# Altium project PCB_Project.PrjPcb
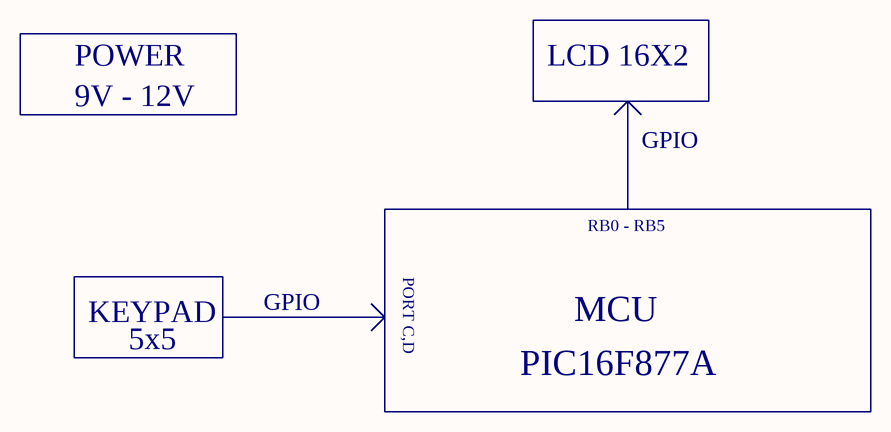
[diagram p0: Diagram.SchDoc]
5 sheets, 47 parts. Net scope: global (net labels, ports and power ports of the same name join across sheets).
Sheets:
  Diagram.SchDoc
  Power.SchDoc
  MCU.SchDoc
  Keypad.SchDoc
  Display.SchDoc

## Sheet Diagram.SchDoc
size A

### Notes on the sheet
- POWER
- 9V - 12V
- LCD 16X2
- GPIO
- RB0 - RB5
- KEYPAD
- PORT C,D
- MCU
- 5x5
- PIC16F877A

## Sheet Power.SchDoc
size A
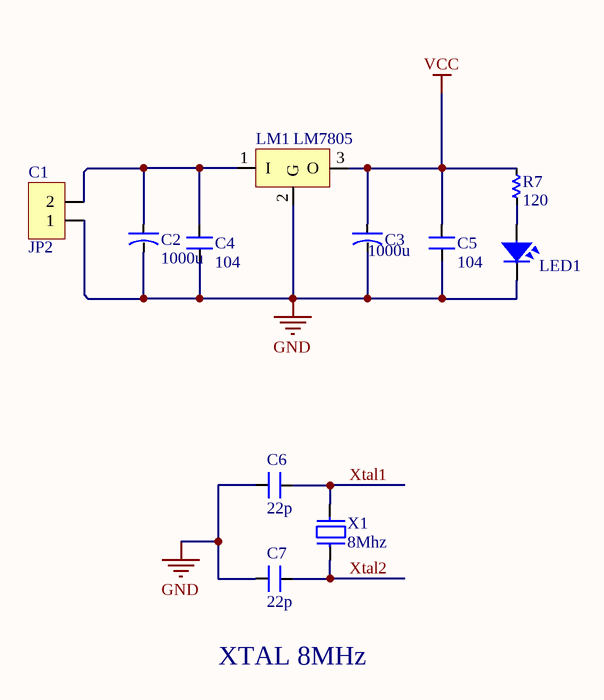
[diagram p1: Power.SchDoc]

### Parts
C1  JP2  [JP2-D1T]
C2  1000u  [CA-ALU-2.54]
C3  1000u  [CA-ALU-2.54]
C4  104  [C-SE-7,5x11x13x9x4]
C5  104  [C-SE-7,5x11x13x9x4]
C6  22p  [C-SE-7,5x11x13x9x4]
C7  22p  [C-SE-7,5x11x13x9x4]
LED1  LED  [LED-3MM-RED]  (value not drawn)
LM1  LM78xx  [TO92-321]  (value not drawn)
R7  120  [RES-1/2W]
X1  8Mhz  [XT2]

### Nets
GND: C1.1 C2.2 C3.2 C4.1 C5.1 C6.1 C7.1 LED1.2 LM1.2(G)
VCC: C3.1 C5.2 LM1.3(O) R7.1
Xtal1: C6.2 X1.2
Xtal2: C7.2 X1.1
NetC1_2: C1.2 C2.1 C4.2 LM1.1(I)
NetLED1_1: LED1.1 R7.2

### Notes on the sheet
- (near LM1) LM7805
- XTAL 8MHz

### Library data of the parts
C1 = JP2: WR-PHD 2.54 mm Angled Socket Header; pin to pad: 1>2 2>1; Manufacturer: W¨¹rth Elektronik eiSos GmbH; partNo: 613002143121; ComponentLink1 Description: Manufacturer; ComponentLink2 Description: Datasheet; NoPins: 02; Rule: PcbType=ProtelPcb; Created Date: 29 March 2013; ComponentLink1URL: http://www.we-online.com; ComponentLink2URL: http://katalog.we-online.de/em/datasheet/6130xx143121.pdf; Created by: Karrer Zheng
C2 C3 = CN-ALU-DIP: Capacitor (Semiconductor SIM Model); Value: 104; LatestRevisionDate: 17-Jul-2002; LatestRevisionNote: Re-released for DXP Platform.; PackageReference: C1206; Publisher: Altium Limited
C4 C5 = CN-SEMI-DIP: Capacitor (Semiconductor SIM Model); LatestRevisionDate: 17-Jul-2002; LatestRevisionNote: Re-released for DXP Platform.; PackageReference: C1206; Publisher: Altium Limited; Value: 104
C6 C7 = CN-SEMI-DIP: Capacitor (Semiconductor SIM Model); Value: 104; LatestRevisionDate: 17-Jul-2002; LatestRevisionNote: Re-released for DXP Platform.; PackageReference: C1206; Publisher: Altium Limited
LED1 = LED: LED Single colour Green and Red; Value: LED 3 ly Single Colour
LM1 = LM78xx: Positive Voltage Regulator; Note: Tab is connected to pin 3 (GND).; Published: 24-Aug-2001; LatestRevisionDate: 17-Jul-2002; LatestRevisionNote: Re-released for DXP Platform.; DatasheetVersion: Apr-1994; PackageVersion: Jul-1998; PackageReference: ISOWATT220AB; Publisher: Altium Limited; PackageDescription: TO, Thru-Hole, Vertical, Heatsink Mounted; 3 In-Line Leads; Pitch 2.54 mm; Pin sequence 1, 3, 2; ComponentLink1Description: Manufacturer Link; ComponentLink1URL: http://www.st.com/; ComponentLink2Description: Datasheet; ComponentLink2URL: http://www.st.com/stonline/products/literature/ds/2146/l78m05c.pdf
R7 = Res: Manufacturer: Generic Components; Class: Passive; SubClass: R; Published: 08/06/2000; Publisher: Altium Hobart Technology Centre
X1 = XT2: Crystal, 32.768 KHz, -40 to 85 degC, 3.2 x 1.5 x 0.9 mm SMD; Value: 4Mhz

## Sheet MCU.SchDoc
size A
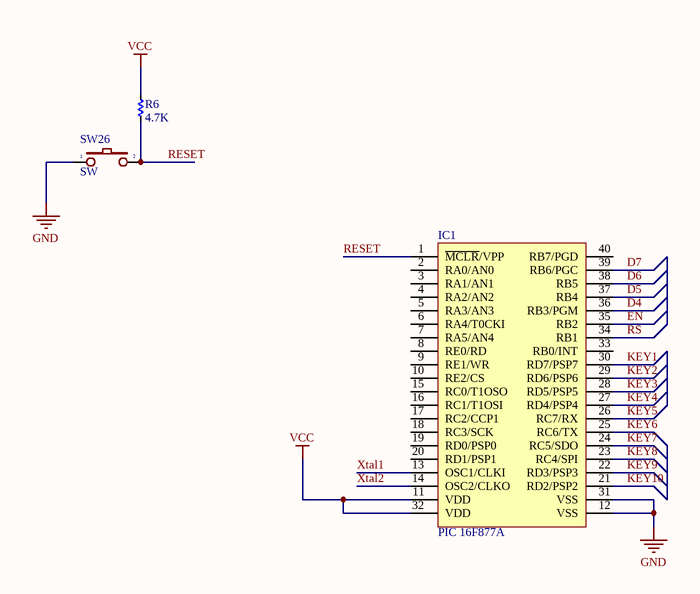
[diagram p2: MCU.SchDoc]

### Parts
IC1  PIC 16F877A  [DIP40/W0.6]
R6  4.7K  [RES-1/2W]
SW26  SW  [SW-DIP1-1]

### Nets
GND: IC1.12(VSS) IC1.31(VSS) SW26.1
VCC: IC1.11(VDD) IC1.32(VDD) R6.1
D4: IC1.36(RB3/PGM)
D5: IC1.37(RB4)
D6: IC1.38(RB5)
D7: IC1.39(RB6/PGC)
EN: IC1.35(RB2)
KEY1: IC1.30(RD7/PSP7)
KEY2: IC1.29(RD6/PSP6)
KEY3: IC1.28(RD5/PSP5)
KEY4: IC1.27(RD4/PSP4)
KEY5: IC1.26(RC7/RX)
KEY6: IC1.25(RC6/TX)
KEY7: IC1.24(RC5/SDO)
KEY8: IC1.23(RC4/SPI)
KEY9: IC1.22(RD3/PSP3)
KEY10: IC1.21(RD2/PSP2)
RESET: IC1.1(~{MCLR}/VPP) R6.2 SW26.2
RS: IC1.34(RB1)
Xtal1: IC1.13(OSC1/CLKI)
Xtal2: IC1.14(OSC2/CLKO)

Not connected (* = marked no-connect by the designer): IC1 2(RA0/AN0) 3(RA1/AN1) 4(RA2/AN2) 5(RA3/AN3) 6(RA4/T0CKI) 7(RA5/AN4) 8(RE0/RD) 9(RE1/WR) 10(RE2/CS) 15(RC0/T1OSO) 16(RC1/T1OSI) 17(RC2/CCP1) 18(RC3/SCK) 19(RD0/PSP0) 20(RD1/PSP1) 33(RB0/INT) 40(RB7/PGD)

### Library data of the parts
IC1 = PIC16F877-PU: 8K FLASH, 368B RAM, 256B EFROM; Value: DIP 40; Value: PIC16F877A; Copyright by: VanDungEvn
R6 = Res: as R7 on sheet Power; Published: 08/06/2000; Publisher: Altium Hobart Technology Centre
SW26 = SW2: Switch button 2 pin; Value: SW chip 2 pin

## Sheet Keypad.SchDoc
size A
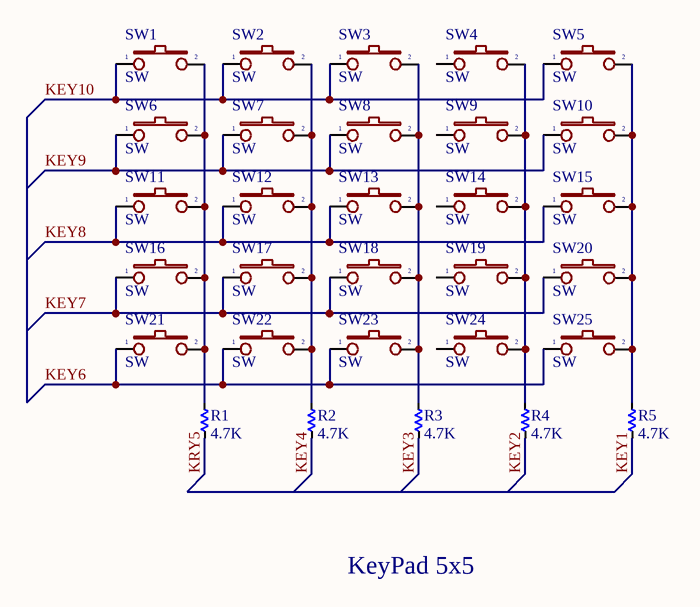
[diagram p3: Keypad.SchDoc]

### Parts
R1  4.7K  [RES-1/2W]
R2  4.7K  [RES-1/2W]
R3  4.7K  [RES-1/2W]
R4  4.7K  [RES-1/2W]
R5  4.7K  [RES-1/2W]
SW1  SW  [SW-DIP1-1]
SW2  SW  [SW-DIP1-1]
SW3  SW  [SW-DIP1-1]
SW4  SW  [SW-DIP1-1]
SW5  SW  [SW-DIP1-1]
SW6  SW  [SW-DIP1-1]
SW7  SW  [SW-DIP1-1]
SW8  SW  [SW-DIP1-1]
SW9  SW  [SW-DIP1-1]
SW10  SW  [SW-DIP1-1]
SW11  SW  [SW-DIP1-1]
SW12  SW  [SW-DIP1-1]
SW13  SW  [SW-DIP1-1]
SW14  SW  [SW-DIP1-1]
SW15  SW  [SW-DIP1-1]
SW16  SW  [SW-DIP1-1]
SW17  SW  [SW-DIP1-1]
SW18  SW  [SW-DIP1-1]
SW19  SW  [SW-DIP1-1]
SW20  SW  [SW-DIP1-1]
SW21  SW  [SW-DIP1-1]
SW22  SW  [SW-DIP1-1]
SW23  SW  [SW-DIP1-1]
SW24  SW  [SW-DIP1-1]
SW25  SW  [SW-DIP1-1]

### Nets
KEY1: R5.2
KEY2: R4.2
KEY3: R3.2
KEY4: R2.2
KEY6: SW21.1 SW22.1 SW23.1 SW25.1
KEY7: SW16.1 SW17.1 SW18.1 SW20.1
KEY8: SW11.1 SW12.1 SW13.1 SW15.1
KEY9: SW6.1 SW7.1 SW8.1 SW10.1
KEY10: SW1.1 SW2.1 SW3.1 SW5.1
KRY5: R1.2
NetR1_1: R1.1 SW1.2 SW6.2 SW11.2 SW16.2 SW21.2
NetR2_1: R2.1 SW2.2 SW7.2 SW12.2 SW17.2 SW22.2
NetR3_1: R3.1 SW3.2 SW8.2 SW13.2 SW18.2 SW23.2
NetR4_1: R4.1 SW4.2 SW9.2 SW14.2 SW19.2 SW24.2
NetR5_1: R5.1 SW5.2 SW10.2 SW15.2 SW20.2 SW25.2

Not connected (* = marked no-connect by the designer): SW4 1; SW9 1; SW14 1; SW19 1; SW24 1

### Notes on the sheet
- KeyPad 5x5

### Library data of the parts
R1-R5 = Res: as R7 on sheet Power; Published: 08/06/2000; Publisher: Altium Hobart Technology Centre
SW1-SW25 = SW2: as SW26 on sheet MCU

## Sheet Display.SchDoc
size A
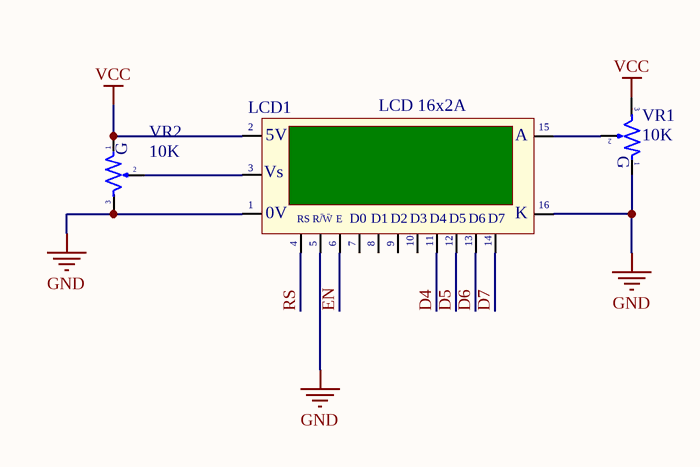
[diagram p4: Display.SchDoc]

### Parts
LCD1  LCD 16x2A  [LCD16X2]
VR1  10K  [VR-S2]
VR2  10K  [VR-S2]

### Nets
GND: LCD1.1(GND) LCD1.5(R/~{W}) LCD1.16(K) VR1.1 VR2.3
VCC: LCD1.2(VDD) VR1.3 VR2.1
D4: LCD1.11(D4)
D5: LCD1.12(D5)
D6: LCD1.13(D6)
D7: LCD1.14(D7)
EN: LCD1.6(~{EN})
RS: LCD1.4(RS)
NetLCD1_3: LCD1.3(VEE) VR2.2
NetLCD1_15: LCD1.15(A) VR1.2

Not connected (* = marked no-connect by the designer): LCD1 7(D0) 8(D1) 9(D2) 10(D3)

### Notes on the sheet
- (in symbol LCD16x2A) 5V; Vs; |; 0V; R/W; E
- (in symbol VR-S) G

### Library data of the parts
LCD1 = LCD16x2A: LCD dipslay 16 char, 2 line; Value: LCD16x2A
VR1 VR2 = VR-S: Var Resistor; Value: Volume 50k

## Nets that join several sheets
GND: Power (9 pins), MCU (IC1.12 IC1.31 SW26.1), Display (5 pins)
VCC: Power (C3.1 C5.2 LM1.3 R7.1), MCU (IC1.11 IC1.32 R6.1), Display (LCD1.2 VR1.3 VR2.1)
D4: MCU (IC1.36), Display (LCD1.11)
D5: MCU (IC1.37), Display (LCD1.12)
D6: MCU (IC1.38), Display (LCD1.13)
D7: MCU (IC1.39), Display (LCD1.14)
EN: MCU (IC1.35), Display (LCD1.6)
KEY1: MCU (IC1.30), Keypad (R5.2)
KEY2: MCU (IC1.29), Keypad (R4.2)
KEY3: MCU (IC1.28), Keypad (R3.2)
KEY4: MCU (IC1.27), Keypad (R2.2)
KEY6: MCU (IC1.25), Keypad (SW21.1 SW22.1 SW23.1 SW25.1)
KEY7: MCU (IC1.24), Keypad (SW16.1 SW17.1 SW18.1 SW20.1)
KEY8: MCU (IC1.23), Keypad (SW11.1 SW12.1 SW13.1 SW15.1)
KEY9: MCU (IC1.22), Keypad (SW6.1 SW7.1 SW8.1 SW10.1)
KEY10: MCU (IC1.21), Keypad (SW1.1 SW2.1 SW3.1 SW5.1)
RS: MCU (IC1.34), Display (LCD1.4)
Xtal1: Power (C6.2 X1.2), MCU (IC1.13)
Xtal2: Power (C7.2 X1.1), MCU (IC1.14)